# EAGLE schematic schematic (EAGLE 9.7.0)
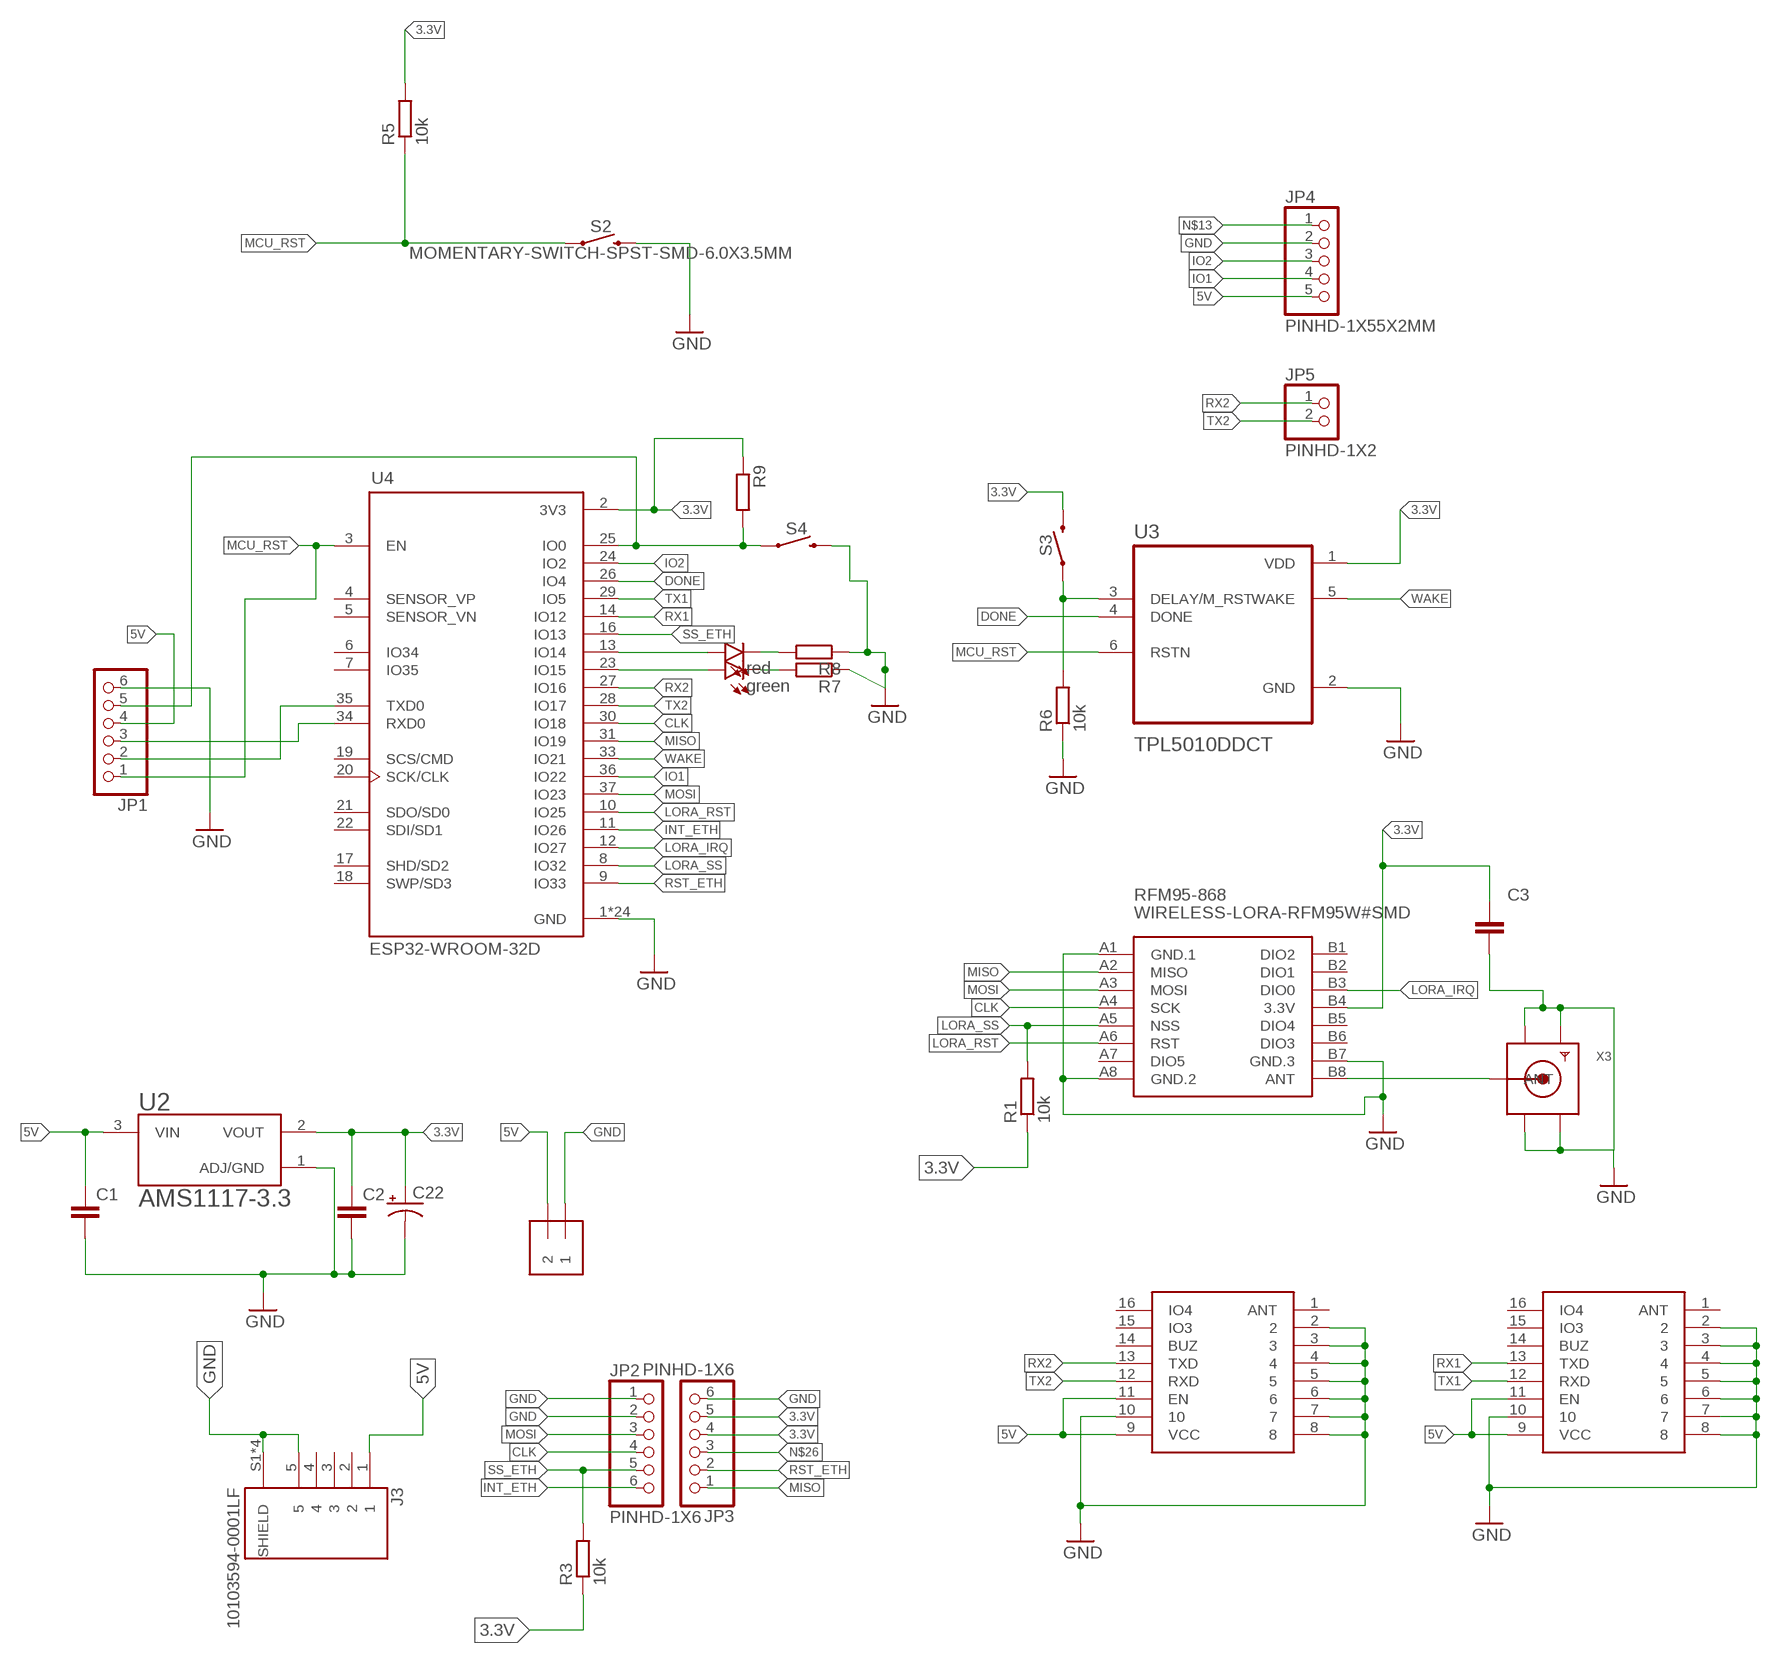
[diagram p0: schematic, sheet 1]

## Parts
C1  C-EUC0603  [C0603]
C2  C-EUC0603  [C0603]
C3  C_CHIP-0603(1608-METRIC)  [CAPC1608X85]
C22  CPOL-USD/7343-31W  [D/7343-31W]
J1  1X2-3.5MM  [1X2-3.5MM]
J3  10103594-0001LF  [10103594-0001LF]
JP1  PINHD-1X6  [1X06]
JP2  PINHD-1X6  [1X06]
JP3  PINHD-1X6  [1X06]
JP4  PINHD-1X55X2MM  [1_05X2MM]
JP5  PINHD-1X2  [1X02]
LORA1  red  LEDCHIP-LED0603  [CHIP-LED0603]
R1  10k  R-EU_R0603  [R0603]
R3  10k  R-EU_R0603  [R0603]
R5  10k  R-EU_R0603  [R0603]
R6  10k  R-EU_R0603  [R0603]
R7  R-EU_R0603  [R0603]
R8  R-EU_R0603  [R0603]
R9  R-EU_R0603  [R0603]
RFM95-868  WIRELESS-LORA-RFM95W#SMD  [WIRELESS-LORA-RFM95W#SMD]
S2  MOMENTARY-SWITCH-SPST-SMD-6.0X3.5MM  [TACTILE_SWITCH_SMD_6.0X3.5MM]
S3  MOMENTARY-SWITCH-SPST-SMD-6.0X3.5MM  [TACTILE_SWITCH_SMD_6.0X3.5MM]
S4  MOMENTARY-SWITCH-SPST-SMD-6.0X3.5MM  [TACTILE_SWITCH_SMD_6.0X3.5MM]
U2  AMS1117-3.3  [SOT229P700X180-4N]
U3  TPL5010DDCT  [SOT95P280X110-6N]
U4  ESP32-WROOM-32D  [MODULE_ESP32-WROOM-32D]
U$1  PR9200  [PR9200]
U$2  PR9200  [PR9200]
UART1  green  LEDCHIP-LED0603  [CHIP-LED0603]
X3  SMACONNECTOR_EDGE_UFL  [SMA_EDGELAUNCH_UFL]

## Nets
3.3V: C2.1 C3.1 C22.+ JP3.4 JP3.5 R1.1 R3.1 R5.2 R9.1 RFM95-868.B4(3.3V) S3.2 U2.2(VOUT) U3.1(VDD) U4.2(3V3)
5V: C1.1 J1.2 J3.1 JP1.4 JP4.5 U2.3(VIN) U$1.9(VCC) U$1.11(EN) U$2.9(VCC) U$2.11(EN)
CLK: JP2.4 RFM95-868.A4(SCK) U4.30(IO18)
DONE: U3.4(DONE) U4.26(IO4)
GND: C1.2 C2.2 C3.2 C22.- J1.1 J3.5 J3.S1(SHIELD) J3.S2(SHIELD) J3.S3(SHIELD) J3.S4(SHIELD) JP1.6 JP2.1 JP2.2 JP3.6 JP4.2 R6.1 R7.1 R8.1 RFM95-868.A1(GND.1) RFM95-868.A8(GND.2) RFM95-868.B7(GND.3) S2.2 S4.2 U2.1(ADJ/GND) U3.2(GND) U4.1(GND) U4.15(GND) U4.38(GND) U4.39_1(GND) U4.39_2(GND) U4.39_3(GND) U4.39_4(GND) U4.39_5(GND) U4.39_6(GND) U4.39_7(GND) U4.39_8(GND) U4.39_9(GND) U4.39_10(GND) U4.39_11(GND) U4.39_12(GND) U4.39_13(GND) U4.39_14(GND) U4.39_15(GND) U4.39_16(GND) U4.39_17(GND) U4.39_18(GND) U4.39_19(GND) U4.39_20(GND) U4.39_21(GND) U$1.2 U$1.3 U$1.4 U$1.5 U$1.6 U$1.7 U$1.8 U$1.10 U$2.2 U$2.3 U$2.4 U$2.5 U$2.6 U$2.7 U$2.8 U$2.10 X3.GND@1(GND1) X3.GND@2(GND2) X3.GND@3(GND3) X3.GND@4(GND4)
INT_ETH: JP2.6 U4.11(IO26)
IO1: JP4.4 U4.36(IO22)
IO2: JP4.3 U4.24(IO2)
LORA_IRQ: RFM95-868.B3(DIO0) U4.12(IO27)
LORA_RST: RFM95-868.A6(RST) U4.10(IO25)
LORA_SS: R1.2 RFM95-868.A5(NSS) U4.8(IO32)
MCU_RST: JP1.1 R5.1 S2.1 U3.6(RSTN) U4.3(EN)
MISO: JP3.1 RFM95-868.A2(MISO) U4.31(IO19)
MOSI: JP2.3 RFM95-868.A3(MOSI) U4.37(IO23)
N$1: U4.23(IO15) UART1.A
N$2: R6.2 S3.1 U3.3(DELAY/M_RST)
N$3: R7.2 UART1.C
N$4: LORA1.A U4.13(IO14)
N$5: LORA1.C R8.2
N$6: JP1.5 R9.2 S4.1 U4.25(IO0)
N$8: JP1.3 U4.34(RXD0)
N$9: JP1.2 U4.35(TXD0)
N$13: JP4.1
N$26: JP3.3
N$55: RFM95-868.B8(ANT) X3.P(ANT)
RST_ETH: JP3.2 U4.9(IO33)
RX1: U4.14(IO12) U$2.13(TXD)
RX2: JP5.1 U4.27(IO16) U$1.13(TXD)
SS_ETH: JP2.5 R3.2 U4.16(IO13)
TX1: U4.29(IO5) U$2.12(RXD)
TX2: JP5.2 U4.28(IO17) U$1.12(RXD)
WAKE: U3.5(WAKE) U4.33(IO21)
Unconnected: J3.2 J3.3 J3.4 RFM95-868.A7(DIO5) RFM95-868.B1(DIO2) RFM95-868.B2(DIO1) RFM95-868.B5(DIO4) RFM95-868.B6(DIO3) U4.4(SENSOR_VP) U4.5(SENSOR_VN) U4.6(IO34) U4.7(IO35) U4.17(SHD/SD2) U4.18(SWP/SD3) U4.19(SCS/CMD) U4.20(SCK/CLK) U4.21(SDO/SD0) U4.22(SDI/SD1) U$1.1(ANT) U$1.14(BUZ) U$1.15(IO3) U$1.16(IO4) U$2.1(ANT) U$2.14(BUZ) U$2.15(IO3) U$2.16(IO4)

## Library data of the parts
C1 C2 = rcl:C-EU: CAPACITOR, European symbol; SPICEPREFIX: C
C3 = Tutorial - Fusion 360:C: Capacitor - Generic; CATEGORY: Capacitor
C22 = adafruit:CPOL-US: POLARIZED CAPACITOR, American symbol
J1 = adafruit:1X2: 3.5mm Terminal block http://www.ladyada.net/library/pcb/eaglelibrary.html
J3 = Connectors:10103594-0001LF: CONN RCPT USB2.0 MICRO B SMD R/A Manufacturer's datasheet <https://cdn.amphenol-icc.com/media/wysiwyg/files/drawing/10103594.pdf>; CREATED_BY: PCBLayout.com; DIGIKEY_PART_NUMBER: 609-4050-2-ND; MANUFACTURER: Amphenol ICC (FCI); MPN: 10103594-0001LF
JP1 = adafruit:PINHD-1X6: PIN HEADER
JP2 JP3 = Connector:PINHD-1X6: PIN HEADER; CATEGORY: CONNECTOR; SUB-CATEGORY: PIN-HEADER
JP4 = Connector:PINHD-1X5: PIN HEADER; CATEGORY: CONNECTOR; SUB-CATEGORY: PIN-HEADER
JP5 = Connector:PINHD-1X2: PIN HEADER; CATEGORY: CONNECTOR; SUB-CATEGORY: PIN-HEADER
LORA1 UART1 = led:LED: LED OSRAM: - CHIPLED LG R971, LG N971, LY N971, LG Q971, LY Q971, LO R971, LY R971 LH N974, LH R974 LS Q976, LO Q976, LY Q976 LO Q996 - Hyper CHIPLED LW Q18S LB Q993, LB Q99A, LB R99A - SideLED LS A670, LO A670, LY A670, LG A670, LP A670 LB A673, LV A673, LT A673, LW A673 LH A674 LY A675 LS A676, LA A676, LO A676, LY A676, LW A676 LS A679, LY A679, LG A679 - Hyper Micro SIDELED® LS Y876, LA Y876, LO Y876, LY Y876 LT Y87S - SmartLED LW L88C, LW L88S LB L89C, LB L89S, LG L890 LS L89K, LO L89K, LY L89K LS L896, LA L896, LO L896, LY L896 - TOPLED LS T670, LO T670, LY T670, LG T670, LP T670 LSG T670, LSP T670, LSY T670, LOP T670, LYG T670 LG T671, LOG T671, LSG T671 LB T673, LV T673, LT T673, LW T673 LH T674 LS T676, LA T676, LO T676, LY T676, LB T676, LH T676, LSB T676, LW T676 LB T67C, LV T67C, LT T67C, LS T67K, LO T67K, LY T67K, LW E67C LS E67B, LA E67B, LO E67B, LY E67B, LB E67C, LV E67C, LT E67C LW T67C LS T679, LY T679, LG T679 LS T770, LO T770, LY T770, LG T770, LP T770 LB T773, LV T773, LT T773, LW T773 LH T774 LS E675, LA E675, LY E675, LS T675 LS T776, LA T776, LO T776, LY T776, LB T776 LHGB T686 LT T68C, LB T68C - Hyper Mini TOPLED® LB M676 - Mini TOPLED Santana® LG M470 LS M47K, LO M47K, LY M47K Source: http://www.osram.convergy.de LUXEON: - LUMILED® LXK2-PW12-R00, LXK2-PW12-S00, LXK2-PW14-U00, LXK2-PW14-V00 LXK2-PM12-R00, LXK2-PM12-S00, LXK2-PM14-U00 LXK2-PE12-Q00, LXK2-PE12-R00, LXK2-PE12-S00, LXK2-PE14-T00, LXK2-PE14-U00 LXK2-PB12-K00, LXK2-PB12-L00, LXK2-PB12-M00, LXK2-PB14-N00, LXK2-PB14-P00, LXK2-PB14-Q00 LXK2-PR12-L00, LXK2-PR12-M00, LXK2-PR14-Q00, LXK2-PR14-R00 LXK2-PD12-Q00, LXK2-PD12-R00, LXK2-PD12-S00 LXK2-PH12-R00, LXK2-PH12-S00 LXK2-PL12-P00, LXK2-PL12-Q00, LXK2-PL12-R00 Source: www.luxeon.com KINGBRIGHT: KA-3528ASYC Source: www.kingbright.com
R1 R3 R5-R9 = rcl:R-EU_: RESISTOR, European symbol; SPICEPREFIX: R
RFM95-868 = diy-modules:WIRELESS-LORA-RFM95W: 868/915 MHz LoRa Radio Transceiver Module based on SX1276 chip Click here to find device on ebay.com <http://www.ebay.com/sch/RFM95W+transceiver>
S2-S4 = SparkFun-Switches:MOMENTARY-SWITCH-SPST: Momentary Switch (Pushbutton) - SPST Normally-open (NO) SPST momentary switches (buttons, pushbuttons). Variants PTH-12MM - 12mm square, through-hole Momentary Pushbutton Switch - 12mm Square <https://www.sparkfun.com/products/9190> (COM-09190) PTH-6.0MM, PTH-6.0MM-KIT - 6.0mm square, through-hole Mini Pushbutton Switch <https://www.sparkfun.com/products/97> (COM-00097) KIT package intended for soldering kit's - only one side of pads' copper is exposed. PTH-RIGHT-ANGLE-KIT - Right-angle, through-hole Right Angle Tactile Button <https://www.sparkfun.com/products/10791> - Used on SparkFun BigTime Watch Kit <https://www.sparkfun.com/products/11734> SMD-12MM - 12mm square, surface-mount Tactile Button - SMD (12mm) <https://www.sparkfun.com/products/12993> (COM-12993) Used on SparkFun PicoBoard <https://www.sparkfun.com/products/11888> SMD-4.5MM - 4.5mm Square Trackball Switch Used on SparkFun Blackberry Trackballer Breakout <https://www.sparkfun.com/products/13169> SMD-4.6MMX2.8MM - 4.60mm x 2.80mm, surface mount Used on SparkFun SAMD21 Mini Breakout <https://www.sparkfun.com/products/13664> SMD-5.2MM, SMD-5.2-REDUNDANT - 5.2mm square, surface-mount Mini Pushbutton Switch - SMD <https://www.sparkfun.com/products/8720> (COM-08720) Used on Arduino Pro Mini <https://www.sparkfun.com/products/11114> REDUNDANT package connects both switch circuits together SMD-6.0X3.5MM - 6.0 x 3.5mm, surface mount Momentary Reset Switch SMD <https://www.sparkfun.com/products/8229> (COM-08229) SMD-6.2MM-TALL - 6.2mm square, surface mount Tactile Button - SMD (6mm) <https://www.sparkfun.com/products/12992> Used on SparkFun Digital Sandbox <https://www.sparkfun.com/products/12651> SMD-RIGHT-ANGLE - Right-angle, surface mount Used on SparkFun Block for Intel® Edison - Arduino <https://www.sparkfun.com/products/13036>; PROD_ID: SWCH-00815; SF_SKU: COM-08229
U2 = AMS1117-3.3:AMS1117-3.3: Sot223/Pkg 1-Amp 3.3-Volt Low Drop Out Voltage Regulatator; AVAILABILITY: Unavailable; DESCRIPTION: Sot223/Pkg 1-Amp 3.3-Volt Low Drop Out Voltage Regulatator; MF: Advanced Monolithic Systems; MP: AMS1117-3.3; PACKAGE: None; PRICE: None
U3 = TPL5010DDCT:TPL5010DDCT: Check prices <https://snapeda.com/parts/TPL5010DDCT/Texas%20Instruments/view-part/?ref=eda>; ARROW_ASIA-PURCHASE-URL: https://snapeda.com/shop?store=Arrow+Asia&id=219132; ARROW_ELECTRONICS-PURCHASE-URL: https://snapeda.com/shop?store=Arrow+Electronics&id=219132; AVAILABILITY: Good; DESCRIPTION: Ultra-low power timer with watchdog functionality & manual reset 6-SOT-23-THIN -40 to 105; DIGIKEY-PURCHASE-URL: https://snapeda.com/shop?store=DigiKey&id=219132; MF: Texas Instruments; MOUSER-PURCHASE-URL: https://snapeda.com/shop?store=Mouser&id=219132; MP: TPL5010DDCT; PACKAGE: SOT-23-THN-6 Texas Instruments; PRICE: None; TEXAS_INSTRUMENTS-PURCHASE-URL: https://snapeda.com/shop?store=Texas+Instruments&id=219132
U4 = ESP32-WROOM-32D:ESP32-WROOM-32D: Bluetooth, WiFi 802.11b/g/n, Bluetooth v4.2 + EDR, Class 1, 2 and 3 Transceiver Module 2.4GHz ~ 2.5GHz Integrated, Trace Surface Mount; AVAILABILITY: Unavailable; DESCRIPTION: Bluetooth, WiFi 802.11b/g/n, Bluetooth v4.2 +EDR, Class 1, 2 and 3 Transceiver Module 2.4GHz ~ 2.5GHz Integrated, Trace Surface Mount; MF: Espressif Systems; MP: ESP32-WROOM-32D; PACKAGE: Module Espressif Systems; PRICE: None
U$1 U$2 = pr9200:PR9200
X3 = adafruit:SMACONNECTOR: SMA Connector 90° DIP SMA Connector, 50 Ohm (4UConnector: 07259)